# EasyEDA Pro project ax08_duplicate.eprj, board ax08 1.0
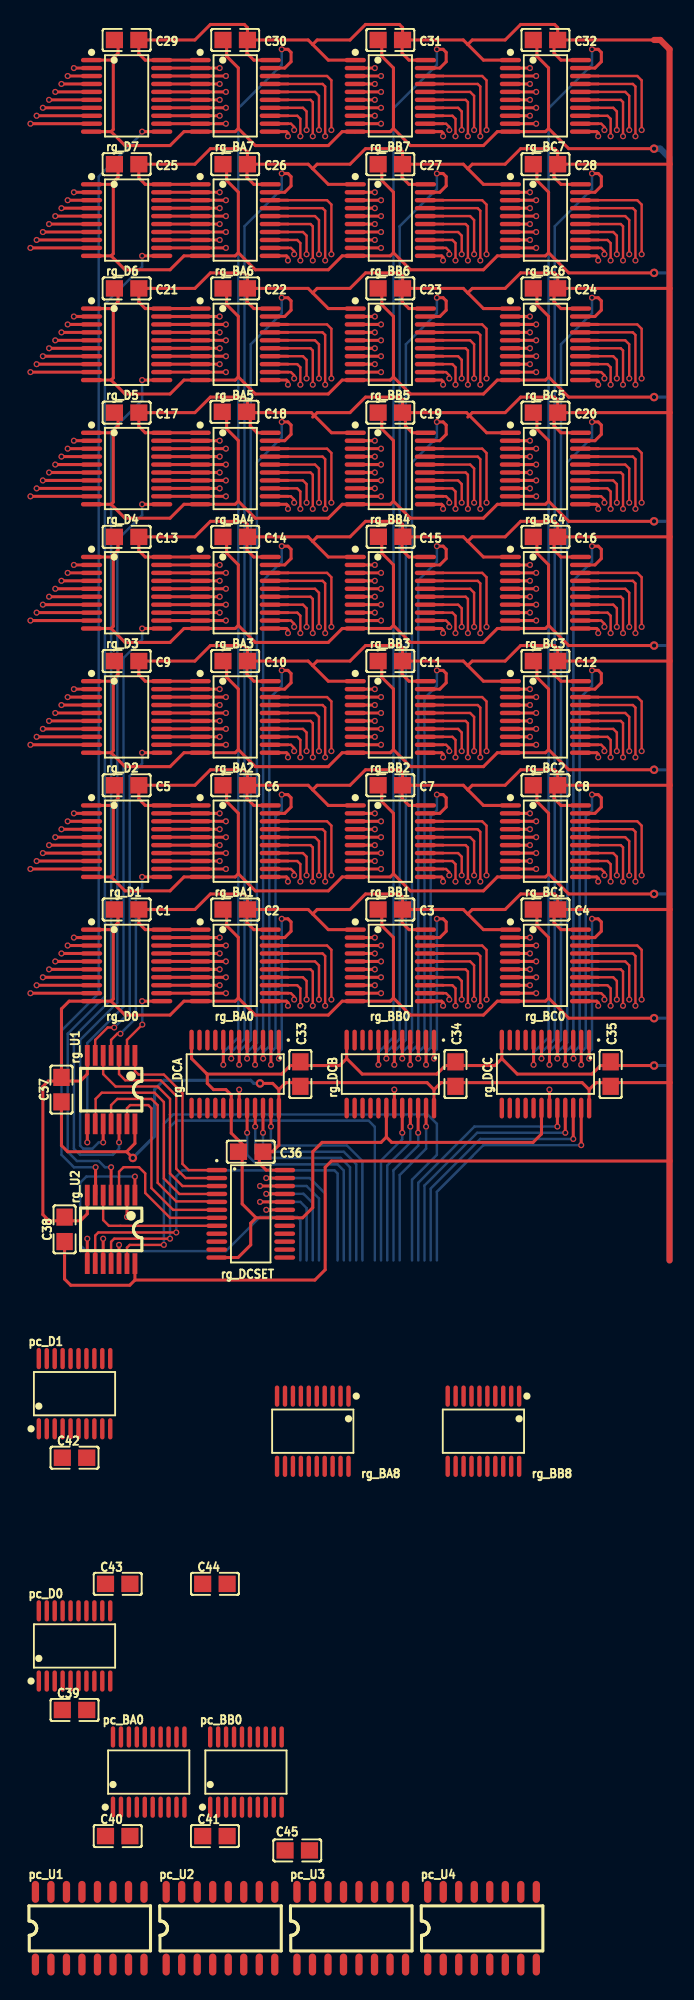
[diagram p7: board, top side]
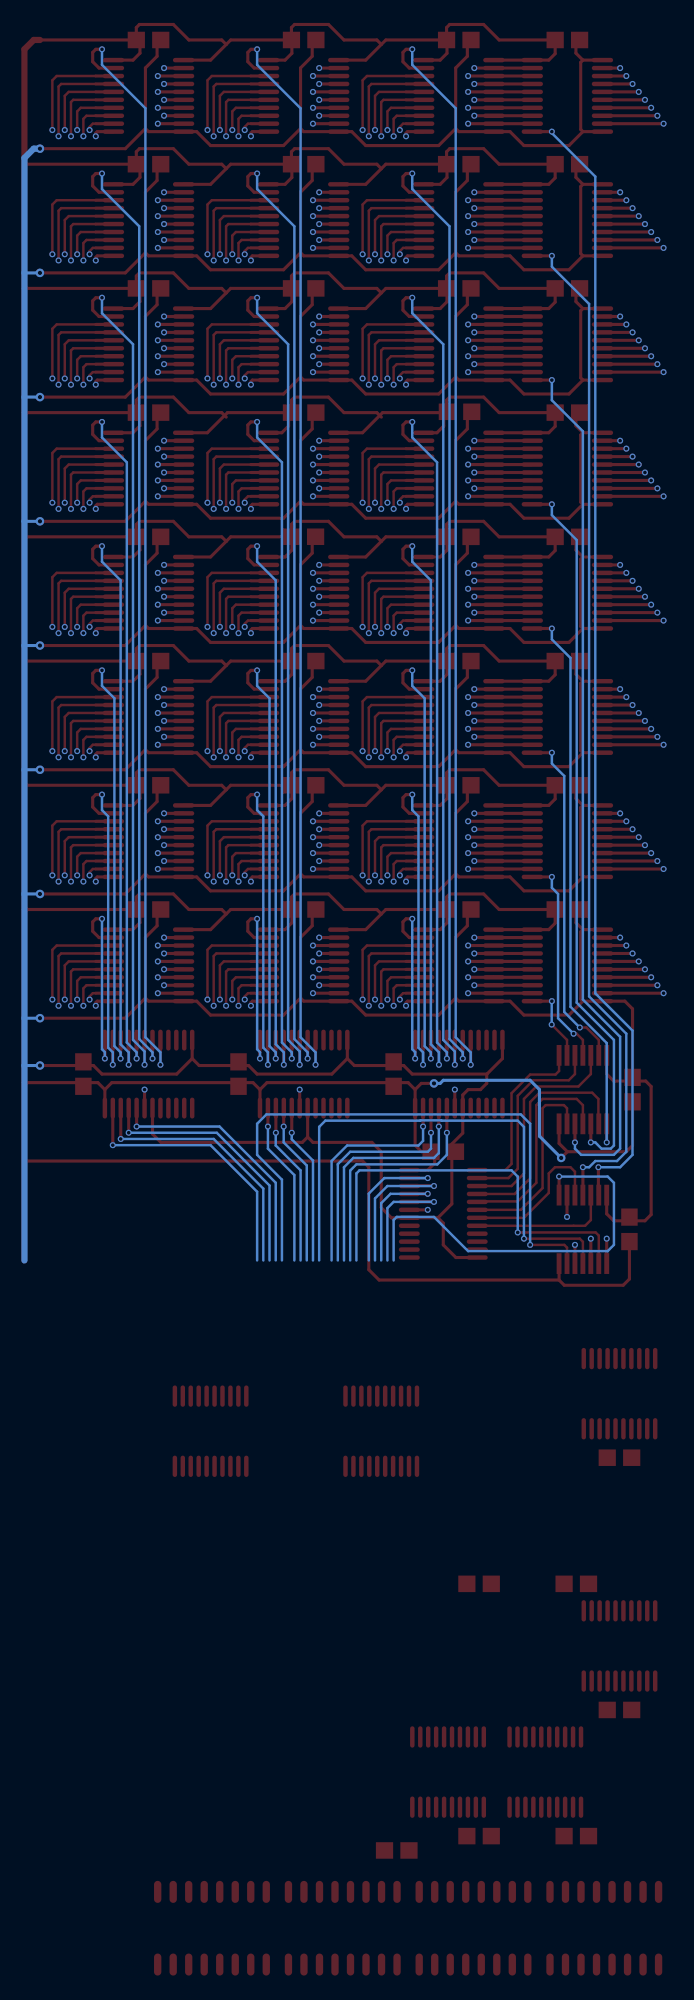
[diagram p8: board, bottom side, seen from below]

No outline. copper layers: Top Layer, Inner1, Inner2, Bottom Layer. Coordinates in mm from the lowest, leftmost part position.
Stack: Top Layer 0.035mm Outer layer thickness 1oz / Dielectric1 0.2104mm 7628 RC49% 8.6mil / Inner1 0.0152mm Inner layer thickness / Dielectric2 1.065mm 1.1mm H/HOZ Copper / Inner2 0.0152mm Inner layer thickness / Dielectric3 0.2104mm 7628 RC49% 8.6mil / Bottom Layer 0.035mm Outer layer thickness 1oz

## Design rules (mm)
template: JLCPCB Capability(Two Layers Board)
spacing copperThickness1oz (default): track to track 0.102, other pairs 0.152 to 0.3
spacing copperThickness2oz: track to track 0.203, other pairs 0.152 to 0.3
track width copperThickness1oz (default): min 0.127, default 0.254, max 2.54
track width copperThickness2oz: min 0.203, default 0.254, max 2.54
differential pair differentialPair (default): width min 0.127, default 0.254, max 2.54; gap min 0.152, default 0.152
via viaSize (default): diameter min 0.5, default 0.61, max 10; hole min 0.3, default 0.305, max 6.3

## Placement (name value [footprint] x y rotation side)
C1  100nF  [C0805]  5.33 83.32 0 top
C2  100nF  [C0805]  14.22 83.32 0 top
C3  100nF  [C0805]  26.92 83.32 0 top
C4  100nF  [C0805]  39.62 83.32 0 top
C5  100nF  [C0805]  5.33 93.48 0 top
C6  100nF  [C0805]  14.22 93.48 0 top
C7  100nF  [C0805]  26.92 93.48 0 top
C8  100nF  [C0805]  39.62 93.48 0 top
C9  100nF  [C0805]  5.33 103.64 0 top
C10  100nF  [C0805]  14.22 103.64 0 top
C11  100nF  [C0805]  26.92 103.64 0 top
C12  100nF  [C0805]  39.62 103.64 0 top
C13  100nF  [C0805]  5.33 113.8 0 top
C14  100nF  [C0805]  14.22 113.8 0 top
C15  100nF  [C0805]  26.95 113.81 0 top
C16  100nF  [C0805]  39.62 113.8 0 top
C17  100nF  [C0805]  5.33 123.96 0 top
C18  100nF  [C0805]  14.16 124.03 0 top
C19  100nF  [C0805]  26.92 123.96 0 top
C20  100nF  [C0805]  39.62 123.96 0 top
C21  100nF  [C0805]  5.33 134.12 0 top
C22  100nF  [C0805]  14.22 134.12 0 top
C23  100nF  [C0805]  26.92 134.12 0 top
C24  100nF  [C0805]  39.62 134.12 0 top
C25  100nF  [C0805]  5.33 144.28 0 top
C26  100nF  [C0805]  14.22 144.28 0 top
C27  100nF  [C0805]  26.92 144.28 0 top
C28  100nF  [C0805]  39.62 144.28 0 top
C29  100nF  [C0805]  5.33 154.44 0 top
C30  100nF  [C0805]  14.22 154.44 0 top
C31  100nF  [C0805]  26.92 154.44 0 top
C32  100nF  [C0805]  39.62 154.44 0 top
C33  100nF  [C0805]  19.56 69.86 90 top
C34  100nF  [C0805]  32.26 69.86 90 top
C35  100nF  [C0805]  44.96 69.86 90 top
C36  100nF  [C0805]  15.49 63.51 180 top
C37  100nF  [C0805]  0 68.59 270 top
C38  100nF  [C0805]  0.25 57.16 270 top
C39  100nF  [C0805]  1.07 17.85 0 top
C40  100nF  [C0805]  4.6 7.53 0 top
C41  100nF  [C0805]  12.56 7.53 0 top
C42  100nF  [C0805]  1.07 38.48 0 top
C43  100nF  [C0805]  4.6 28.17 0 top
C44  100nF  [C0805]  12.56 28.17 0 top
C45  100nF  [C0805]  19.3 6.36 0 top
pc_BA0  74HC245PW,118  [TSSOP-20_L6.5-W4.4-P0.65-LS6.4-BL]  7.14 12.77 0 top
pc_BB0  74HC245PW,118  [TSSOP-20_L6.5-W4.4-P0.65-LS6.4-BL]  15.1 12.77 0 top
pc_D0  74HC574PW,118  [TSSOP-20_L6.5-W4.4-P0.65-LS6.4-BL]  1.07 23.09 0 top
pc_D1  74HC574PW,118  [TSSOP-20_L6.5-W4.4-P0.65-LS6.4-BL]  1.07 43.72 0 top
pc_U1  SN74LS283DR(LX)  [SOIC-16_L9.9-W3.9-P1.27-LS6.0-BL-1]  2.31 0 0 top
pc_U2  SN74LS283DR(LX)  [SOIC-16_L9.9-W3.9-P1.27-LS6.0-BL-1]  13.02 0 0 top
pc_U3  SN74LS283DR(LX)  [SOIC-16_L9.9-W3.9-P1.27-LS6.0-BL-1]  23.72 0 0 top
pc_U4  SN74LS283DR(LX)  [SOIC-16_L9.9-W3.9-P1.27-LS6.0-BL-1]  34.43 0 0 top
rg_BA0  74HC245PW,118  [TSSOP-20_L6.5-W4.4-P0.65-LS6.4-BL]  14.22 78.75 270 top
rg_BA1  74HC245PW,118  [TSSOP-20_L6.5-W4.4-P0.65-LS6.4-BL]  14.22 88.91 270 top
rg_BA2  74HC245PW,118  [TSSOP-20_L6.5-W4.4-P0.65-LS6.4-BL]  14.22 99.07 270 top
rg_BA3  74HC245PW,118  [TSSOP-20_L6.5-W4.4-P0.65-LS6.4-BL]  14.22 109.23 270 top
rg_BA4  74HC245PW,118  [TSSOP-20_L6.5-W4.4-P0.65-LS6.4-BL]  14.22 119.39 270 top
rg_BA5  74HC245PW,118  [TSSOP-20_L6.5-W4.4-P0.65-LS6.4-BL]  14.22 129.55 270 top
rg_BA6  74HC245PW,118  [TSSOP-20_L6.5-W4.4-P0.65-LS6.4-BL]  14.22 139.71 270 top
rg_BA7  74HC245PW,118  [TSSOP-20_L6.5-W4.4-P0.65-LS6.4-BL]  14.22 149.87 270 top
rg_BA8  74HC245PW,118  [TSSOP-20_L6.5-W4.4-P0.65-LS6.4-BL]  20.57 40.65 180 top
rg_BB0  74HC245PW,118  [TSSOP-20_L6.5-W4.4-P0.65-LS6.4-BL]  26.92 78.75 270 top
rg_BB1  74HC245PW,118  [TSSOP-20_L6.5-W4.4-P0.65-LS6.4-BL]  26.92 88.91 270 top
rg_BB2  74HC245PW,118  [TSSOP-20_L6.5-W4.4-P0.65-LS6.4-BL]  26.92 99.07 270 top
rg_BB3  74HC245PW,118  [TSSOP-20_L6.5-W4.4-P0.65-LS6.4-BL]  26.92 109.23 270 top
rg_BB4  74HC245PW,118  [TSSOP-20_L6.5-W4.4-P0.65-LS6.4-BL]  26.92 119.39 270 top
rg_BB5  74HC245PW,118  [TSSOP-20_L6.5-W4.4-P0.65-LS6.4-BL]  26.92 129.55 270 top
rg_BB6  74HC245PW,118  [TSSOP-20_L6.5-W4.4-P0.65-LS6.4-BL]  26.92 139.71 270 top
rg_BB7  74HC245PW,118  [TSSOP-20_L6.5-W4.4-P0.65-LS6.4-BL]  26.92 149.87 270 top
rg_BB8  74HC245PW,118  [TSSOP-20_L6.5-W4.4-P0.65-LS6.4-BL]  34.54 40.65 180 top
rg_BC0  74HC245PW,118  [TSSOP-20_L6.5-W4.4-P0.65-LS6.4-BL]  39.62 78.75 270 top
rg_BC1  74HC245PW,118  [TSSOP-20_L6.5-W4.4-P0.65-LS6.4-BL]  39.62 88.91 270 top
rg_BC2  74HC245PW,118  [TSSOP-20_L6.5-W4.4-P0.65-LS6.4-BL]  39.62 99.07 270 top
rg_BC3  74HC245PW,118  [TSSOP-20_L6.5-W4.4-P0.65-LS6.4-BL]  39.62 109.23 270 top
rg_BC4  74HC245PW,118  [TSSOP-20_L6.5-W4.4-P0.65-LS6.4-BL]  39.62 119.39 270 top
rg_BC5  74HC245PW,118  [TSSOP-20_L6.5-W4.4-P0.65-LS6.4-BL]  39.62 129.55 270 top
rg_BC6  74HC245PW,118  [TSSOP-20_L6.5-W4.4-P0.65-LS6.4-BL]  39.62 139.71 270 top
rg_BC7  74HC245PW,118  [TSSOP-20_L6.5-W4.4-P0.65-LS6.4-BL]  39.62 149.87 270 top
rg_D0  74HC574PW,118  [TSSOP-20_L6.5-W4.4-P0.65-LS6.4-BL]  5.33 78.75 270 top
rg_D1  74HC574PW,118  [TSSOP-20_L6.5-W4.4-P0.65-LS6.4-BL]  5.33 88.91 270 top
rg_D2  74HC574PW,118  [TSSOP-20_L6.5-W4.4-P0.65-LS6.4-BL]  5.33 99.07 270 top
rg_D3  74HC574PW,118  [TSSOP-20_L6.5-W4.4-P0.65-LS6.4-BL]  5.33 109.23 270 top
rg_D4  74HC574PW,118  [TSSOP-20_L6.5-W4.4-P0.65-LS6.4-BL]  5.33 119.39 270 top
rg_D5  74HC574PW,118  [TSSOP-20_L6.5-W4.4-P0.65-LS6.4-BL]  5.33 129.55 270 top
rg_D6  74HC574PW,118  [TSSOP-20_L6.5-W4.4-P0.65-LS6.4-BL]  5.33 139.71 270 top
rg_D7  74HC574PW,118  [TSSOP-20_L6.5-W4.4-P0.65-LS6.4-BL]  5.33 149.87 270 top
rg_DCA  SN74HC154PW(LX)  [TSSOP-24_L7.8-W4.4-P0.65-LS6.4-BL_1]  14.22 69.86 180 top
rg_DCB  SN74HC154PW(LX)  [TSSOP-24_L7.8-W4.4-P0.65-LS6.4-BL_1]  26.92 69.86 180 top
rg_DCC  SN74HC154PW(LX)  [TSSOP-24_L7.8-W4.4-P0.65-LS6.4-BL_1]  39.62 69.86 180 top
rg_DCSET  SN74HC154PW(LX)  [TSSOP-24_L7.8-W4.4-P0.65-LS6.4-BL_1]  15.49 58.43 270 top
rg_U1  74HC14PW,118  [TSSOP-14_L5.0-W4.4-P0.65-LS6.4-BL]  4.06 68.59 180 top
rg_U2  74HC14PW,118  [TSSOP-14_L5.0-W4.4-P0.65-LS6.4-BL]  4.06 57.16 180 top

## Footprints (pads in the part's own frame, mm; a bottom-side part is the same pattern mirrored in y, then rotated)
C0805
  rect 1.41x1.35 smd: 1(-1,0) 2(1,0)
SOIC-16_L9.9-W3.9-P1.27-LS6.0-BL-1
  oval 0.6x1.8 smd: 1(-4.445,-2.972) 2(-3.175,-2.972) 3(-1.905,-2.972) 4(-0.635,-2.972) 5(0.635,-2.972) 6(1.905,-2.972) 7(3.175,-2.972) 8(4.445,-2.972) 9(4.445,2.972) 10(3.175,2.972) 11(1.905,2.972) 12(0.635,2.972) 13(-0.635,2.972) 14(-1.905,2.972) 15(-3.175,2.972) 16(-4.445,2.972)
TSSOP-14_L5.0-W4.4-P0.65-LS6.4-BL
  rect 0.4x1.7 smd: 1(-1.95,-2.8) 2(-1.3,-2.8) 3(-0.65,-2.8) 4(0,-2.8) 5(0.65,-2.8) 6(1.3,-2.8) 7(1.95,-2.8) 8(1.95,2.8) 9(1.3,2.8) 10(0.65,2.8) 11(0,2.8) 12(-0.65,2.8) 13(-1.3,2.8) 14(-1.95,2.8)
TSSOP-20_L6.5-W4.4-P0.65-LS6.4-BL
  oval 0.364x1.742 smd: 1(-2.925,-2.871) 2(-2.275,-2.871) 3(-1.625,-2.871) 4(-0.975,-2.871) 5(-0.325,-2.871) 6(0.325,-2.871) 7(0.975,-2.871) 8(1.625,-2.871) 9(2.275,-2.871) 10(2.925,-2.871) 11(2.925,2.871) 12(2.275,2.871) 13(1.625,2.871) 14(0.975,2.871) 15(0.325,2.871) 16(-0.325,2.871) 17(-0.975,2.871) 18(-1.625,2.871) 19(-2.275,2.871) 20(-2.925,2.871)
TSSOP-24_L7.8-W4.4-P0.65-LS6.4-BL_1
  oval 0.364x1.71 smd: 1(-3.575,-2.78) 2(-2.925,-2.78) 3(-2.275,-2.78) 4(-1.625,-2.78) 5(-0.975,-2.78) 6(-0.325,-2.78) 7(0.325,-2.78) 8(0.975,-2.78) 9(1.625,-2.78) 10(2.275,-2.78) 11(2.925,-2.78) 12(3.575,-2.78) 13(3.575,2.78) 14(2.925,2.78) 15(2.275,2.78) 16(1.625,2.78) 17(0.975,2.78) 18(0.325,2.78) 19(-0.325,2.78) 20(-0.975,2.78) 21(-1.625,2.78) 22(-2.275,2.78) 23(-2.925,2.78) 24(-3.575,2.78)

## Nets
As in the schematic.

Pads without a net: C45 1 2; pc_U1 1 2 3 4 5 6 7 8 9 10 11 12 13 14 15 16; pc_U2 1 2 3 4 5 6 7 8 9 10 11 12 13 14 15 16; pc_U3 1 2 3 4 5 6 7 8 9 10 11 12 13 14 15 16; pc_U4 1 2 3 4 5 6 7 8 9 10 11 12 13 14 15 16; rg_DCA 11 13 14 15 16 17; rg_DCB 11 13 14 15 16 17; rg_DCC 9 10 11 13 14 15 16 17; rg_DCSET 9 10 11 13 14 15 16 17

## Via types
v1: diameter 0.7, hole 0.35, Top Layer to Bottom Layer, 11 vias
v2: diameter 0.5, hole 0.3, Top Layer to Bottom Layer, 540 vias

## Routing (per net, layer and track width the routed paths; a pad name or vN(x,y) marks a point on that pad's centre or on a via; arc(x,y) is an arc through that point)
+5V: length 828.2
  Top Layer w0.254: 33.4,123.73 34.81,122.32 37.02,122.32 ; 33.4,123.73 33.63,123.96 36.32,123.96 37.59,125.23 40.37,125.23 40.62,124.98 C20.2 ; 33.4,123.73 33.26,123.6 ; 33.4,123.73 33.16,123.96 28.16,123.96 28.16,122.87 28.71,122.32 30.06,122.32 ; rg_BB2.20 28.45,102 27.89,102.55 27.89,103.64 C11.2 ; C32.2 40.32,154.44 40.32,153.37 40.89,152.8 rg_BC7.20 ; C32.2 40.62,155.46 40.37,155.71 37.59,155.71 36.32,154.44 33.63,154.44 33.26,154.08 ; C32.2 48.51,154.44 ; rg_BA7.20 15.75,152.8 15.19,153.35 15.19,154.44 C30.2 ; 36.75,132.48 34.54,132.48 33.26,133.76 ; 20.56,154.08 20.93,154.44 23.62,154.44 24.89,155.71 27.67,155.71 27.92,155.46 C31.2 ; 20.56,154.08 21.84,152.8 rg_BB7.1 ; 20.56,154.08 20.2,154.44 C30.2 ; rg_BC3.20 40.89,112.16 40.32,112.73 40.32,113.8 C16.2 ; C4.2 40.32,83.32 40.32,82.25 40.89,81.68 rg_BC0.20 ; C4.2 40.62,84.34 40.37,84.59 37.59,84.59 36.32,83.32 33.63,83.32 33.26,82.96 ; C4.2 49.78,83.32 ; rg_BB3.1 21.84,112.16 20.56,113.44 ; C10.2 15.19,103.64 15.19,102.55 15.75,102 rg_BA2.20 ; C10.2 20.2,103.64 20.56,103.28 ; C10.2 15.22,104.66 14.97,104.91 12.19,104.91 10.92,103.64 C9.2 6.33,102.52 6.86,102 rg_BA2.1 ; C30.2 15.22,155.46 14.97,155.71 12.19,155.71 10.92,154.44 C29.2 6.33,153.32 6.86,152.8 rg_BA7.1 ; rg_BC2.1 34.54,102 33.26,103.28 ; rg_BC0.1 34.54,81.68 33.26,82.96 ; 30.5,68.59 29.93,69.16 18.37,69.16 17.8,68.59 ; 30.5,68.59 rg_DCB.24 ; 30.5,68.59 31.07,69.16 42.63,69.16 43.2,68.59 ; C27.2 27.92,145.3 27.67,145.55 24.89,145.55 23.62,144.28 20.93,144.28 20.56,143.92 ; C14.2 15.22,114.82 14.97,115.07 12.19,115.07 10.92,113.8 C13.2 6.33,112.68 6.86,112.16 rg_BA3.1 ; C14.2 20.2,113.8 20.56,113.44 ; C14.2 15.19,113.8 15.19,112.71 15.75,112.16 rg_BA3.20 ; 20.56,113.44 20.93,113.8 23.62,113.8 24.89,115.07 27.67,115.07 27.92,114.82 27.92,113.8 ; v1(16.26,69.1) 17.29,69.1 17.8,68.59 ; C11.2 32.9,103.64 33.26,103.28 ; C11.2 27.92,104.66 27.67,104.91 24.89,104.91 23.62,103.64 20.93,103.64 20.56,103.28 ; 33.26,154.08 34.54,152.8 rg_BC7.1 ; 33.26,154.08 32.9,154.44 C31.2 ; 6.01,53.02 20.75,53.02 21.59,53.86 21.59,62.24 22.1,62.75 49.78,62.75 ; 6.01,53.02 rg_U2.14 ; 6.01,53.02 5.59,52.59 0.76,52.59 0.25,53.1 0.25,56.46 ; C24.2 40.32,134.12 40.32,133.05 40.89,132.48 42.5,132.48 ; C24.2 49.78,134.12 ; C24.2 40.62,135.14 40.37,135.39 37.59,135.39 36.32,134.12 33.63,134.12 33.26,133.76 ; 17.8,68.59 17.8,64.04 17.27,63.51 16.19,63.51 16.19,62.58 16.76,62.01 rg_DCSET.24 ; 20.56,82.96 21.84,81.68 rg_BB0.1 ; 20.56,82.96 20.93,83.32 23.62,83.32 24.89,84.59 27.67,84.59 27.92,84.34 C3.2 ; 20.56,82.96 20.2,83.32 C2.2 ; 33.26,93.12 33.63,93.48 36.32,93.48 37.59,94.75 40.37,94.75 40.62,94.5 C8.2 ; 33.26,93.12 34.54,91.84 rg_BC1.1 ; 33.26,93.12 32.9,93.48 27.89,93.48 27.89,92.39 28.45,91.84 rg_BB1.20 ; C23.2 27.89,134.12 27.89,133.03 28.45,132.48 29.79,132.48 ; C23.2 32.9,134.12 33.26,133.76 ; C23.2 27.92,135.14 27.67,135.39 24.89,135.39 23.62,134.12 20.93,134.12 20.56,133.76 ; 33.26,103.28 33.63,103.64 36.32,103.64 37.59,104.91 40.37,104.91 40.62,104.66 C12.2 ; C16.2 49.78,113.8 ; C16.2 40.62,114.82 40.37,115.07 37.59,115.07 36.32,113.8 33.63,113.8 33.26,113.44 ; C2.2 15.22,84.34 14.97,84.59 12.19,84.59 10.92,83.32 C1.2 6.33,82.2 6.86,81.68 rg_BA0.1 ; C2.2 15.19,83.32 15.19,82.23 15.75,81.68 rg_BA0.20 ; 20.56,103.28 21.84,102 rg_BB2.1 ; 27.92,113.8 32.9,113.8 33.26,113.44 ; 27.92,113.8 27.89,113.8 27.89,112.71 28.45,112.16 rg_BB3.20 ; C22.2 20.2,134.12 20.56,133.76 ; C22.2 15.19,134.12 15.19,133.03 15.75,132.48 17.09,132.48 ; C22.2 15.22,135.14 14.97,135.39 12.19,135.39 10.92,134.12 C21.2 6.33,133 6.86,132.48 11.35,132.48 ; rg_BC2.20 40.89,102 40.32,102.57 40.32,103.64 C12.2 ; 43.2,68.59 43.77,69.16 49.78,69.16 ; 43.2,68.59 rg_DCC.24 ; rg_BC6.20 40.89,142.64 40.32,143.21 40.32,144.28 49.78,144.28 ; C12.2 49.78,103.64 ; 49.78,93.48 40.32,93.48 40.32,92.41 40.89,91.84 rg_BC1.20 ; 49.78,123.96 40.32,123.96 40.32,122.89 40.89,122.32 42.5,122.32 ; 33.26,82.96 32.9,83.32 C3.2 ; 20.56,143.92 20.2,144.28 15.19,144.28 15.19,143.19 15.75,142.64 rg_BA6.20 ; 20.56,143.92 21.84,142.64 rg_BB6.1 ; rg_BB1.1 21.84,91.84 20.56,93.12 ; rg_BA6.1 6.86,142.64 6.33,143.16 C25.2 10.92,144.28 12.19,145.55 14.97,145.55 15.22,145.3 C26.2 ; 11.35,122.32 6.86,122.32 6.33,122.84 C17.2 10.92,123.96 12.19,125.23 14.97,125.23 15.22,124.98 15.22,123.96 ; C31.2 27.89,154.44 27.89,153.35 28.45,152.8 rg_BB7.20 ; C6.2 15.22,94.5 14.97,94.75 12.19,94.75 10.92,93.48 C5.2 6.33,92.36 6.86,91.84 rg_BA1.1 ; 5.33,63.51 6.01,64.19 rg_U1.14 ; 5.33,63.51 v1(5.84,63) ; 5.33,63.51 0.51,63.51 0,64.02 0,67.89 ; C7.2 27.92,94.5 27.67,94.75 24.89,94.75 23.62,93.48 20.93,93.48 20.56,93.12 ; rg_BB6.20 28.45,142.64 27.89,143.19 27.89,144.28 32.9,144.28 33.26,143.92 ; C3.2 27.89,83.32 27.89,82.23 28.45,81.68 rg_BB0.20 ; 33.26,113.44 34.54,112.16 rg_BC3.1 ; 20.56,133.76 21.84,132.48 24.05,132.48 ; rg_BC6.1 34.54,142.64 33.26,143.92 ; C19.2 27.92,124.98 27.67,125.23 24.89,125.23 23.62,123.96 20.93,123.96 20.7,123.73 ; 20.56,93.12 20.2,93.48 15.19,93.48 15.19,92.39 15.75,91.84 rg_BA1.20 ; 33.26,143.92 33.63,144.28 36.32,144.28 37.59,145.55 40.37,145.55 40.62,145.3 C28.2 ; 17.36,122.32 16.01,122.32 15.46,122.87 15.46,123.96 20.46,123.96 20.7,123.73 ; 20.7,123.73 20.56,123.6 ; 20.7,123.73 22.11,122.32 24.32,122.32
  Top Layer w0.508: 48.51,154.44 49.02,154.44 49.78,153.68 49.78,54.62
  Bottom Layer w0.254: v1(5.84,63) 7.62,64.78 7.62,68.59 8.38,69.35 15.49,69.35 15.75,69.1 v1(16.26,69.1)
GND: length 890.8
  Top Layer w0.254: 2.46,132.48 4.06,132.48 ; 4.06,132.48 4.63,133.05 4.63,134.12 ; 4.06,132.48 4.24,132.3 4.24,126.81 4.06,126.63 ; 4.06,85.99 4.24,86.17 4.24,91.66 4.06,91.84 ; 4.06,85.99 2.46,85.99 ; 4.06,85.99 5.2,84.85 8.89,84.85 10.03,85.99 14.22,85.99 14.48,86.24 ; rg_D7.1 4.06,152.8 ; 4.06,152.8 4.63,153.37 4.63,154.44 ; 4.06,152.8 4.24,152.62 4.24,147.13 4.06,146.95 ; 14.48,76.08 15.87,74.69 21.84,74.69 22.98,75.83 rg_BB0.10 26.92,75.83 27.18,76.08 ; 14.48,76.08 14.22,75.83 rg_BA0.10 10.03,75.83 8.89,74.69 5.2,74.69 4.06,75.83 ; 14.48,76.08 14.48,81.04 13.52,81.99 13.52,83.32 ; 14.48,137.04 15.87,135.65 21.84,135.65 22.98,136.79 rg_BB6.10 26.92,136.79 27.18,137.04 ; 14.48,137.04 14.22,136.79 rg_BA6.10 10.03,136.79 8.89,135.65 5.2,135.65 4.06,136.79 ; 14.48,137.04 14.48,142 13.52,142.95 13.52,144.28 ; 11.92,69.86 11.94,69.84 11.94,69.1 12.45,68.59 13.46,68.59 13.9,68.15 rg_DCA.18 13.9,65.04 14.79,64.14 14.79,59.24 15.93,58.11 ; 11.92,69.86 18.03,69.86 18.73,70.56 22.78,70.56 23.35,71.13 ; 11.92,69.86 10.65,71.13 rg_DCA.12 ; 27.18,147.2 26.92,146.95 rg_BB7.10 22.98,146.95 21.84,145.81 15.87,145.81 14.48,147.2 ; 27.18,147.2 28.57,145.81 34.54,145.81 35.68,146.95 rg_BC7.10 39.62,146.95 39.88,147.2 ; 27.18,147.2 27.18,152.16 26.22,153.11 26.22,154.44 ; 15.93,58.11 rg_DCSET.18 19.74,58.11 20.57,58.94 20.57,63.51 21.34,64.27 26.16,64.27 26.6,64.71 ; 15.93,58.11 15.49,57.67 15.49,55.89 14.46,54.86 12.71,54.86 ; 0,69.29 0,75.2 0.63,75.83 rg_D0.10 4.06,75.83 ; 0,69.29 -1.08,69.29 -1.52,68.85 -1.52,58.37 -1.02,57.86 1.54,57.86 2.11,58.43 rg_U2.7 ; 0,69.29 1.54,69.29 2.11,69.86 rg_U1.7 ; 4.06,81.68 4.24,81.5 4.24,76.01 4.06,75.83 ; 4.06,81.68 4.63,82.25 4.63,83.32 ; 4.06,81.68 rg_D0.1 ; 27.18,137.04 27.18,142 26.22,142.95 26.22,144.28 ; 27.18,137.04 28.57,135.65 34.54,135.65 35.68,136.79 rg_BC6.10 39.62,136.79 39.88,137.04 ; 36.05,71.13 37.32,69.86 43.43,69.86 44.13,70.56 v1(48.51,70.56) ; 36.05,71.13 35.48,70.56 31.43,70.56 30.73,69.86 24.62,69.86 23.35,71.13 ; 36.05,71.13 rg_DCC.12 ; 2.46,106.31 4.06,106.31 ; 4.06,106.31 4.24,106.49 4.24,111.98 4.06,112.16 ; 4.06,106.31 5.2,105.17 8.89,105.17 10.03,106.31 14.22,106.31 14.48,106.56 ; rg_DCC.18 39.3,64.96 38.61,64.27 27.04,64.27 26.6,64.71 ; 14.48,86.24 14.48,91.2 13.52,92.15 13.52,93.48 ; 14.48,86.24 15.87,84.85 21.84,84.85 22.98,85.99 26.92,85.99 27.18,86.24 ; 39.88,86.24 39.88,91.2 38.92,92.15 38.92,93.48 ; 39.88,86.24 41.53,84.59 v1(48.51,84.59) ; 39.88,86.24 39.62,85.99 35.68,85.99 34.54,84.85 28.57,84.85 27.18,86.24 ; 39.88,126.88 39.88,131.84 38.92,132.79 38.92,134.12 ; 39.88,126.88 41.53,125.23 v1(48.51,125.23) ; 39.88,126.88 39.62,126.63 rg_BC5.10 35.68,126.63 34.54,125.49 28.57,125.49 27.18,126.88 ; 27.18,126.88 26.92,126.63 rg_BB5.10 22.98,126.63 21.84,125.49 15.87,125.49 14.48,126.88 ; 27.18,126.88 27.18,131.84 26.22,132.79 26.22,134.12 ; 4.06,96.15 4.24,96.33 4.24,101.82 4.06,102 ; 4.06,96.15 5.2,95.01 8.89,95.01 10.03,96.15 14.22,96.15 14.48,96.4 ; 4.06,96.15 2.46,96.15 ; 39.88,147.2 41.53,145.55 v1(48.51,145.55) ; 39.88,147.2 39.88,152.16 38.92,153.11 38.92,154.44 ; 4.06,91.84 rg_D1.1 ; 4.06,91.84 4.63,92.41 4.63,93.48 ; 13.52,154.44 13.52,153.11 14.48,152.16 14.48,147.2 ; 13.52,134.12 13.52,132.79 14.48,131.84 14.48,126.88 ; 39.88,106.56 39.62,106.31 35.68,106.31 34.54,105.17 28.57,105.17 27.18,106.56 ; 39.88,106.56 39.88,111.52 38.92,112.47 38.92,113.8 ; 39.88,106.56 41.53,104.91 v1(48.51,104.91) ; 27.18,116.72 27.18,121.68 26.22,122.63 26.22,123.96 ; 27.18,116.72 26.92,116.47 rg_BB4.10 22.98,116.47 21.84,115.33 15.87,115.33 14.48,116.72 ; 27.18,116.72 28.57,115.33 34.54,115.33 35.68,116.47 rg_BC4.10 39.62,116.47 39.88,116.72 ; 39.88,76.08 39.88,81.04 38.92,81.99 38.92,83.32 ; 39.88,76.08 41.53,74.43 v1(48.51,74.43) ; 39.88,76.08 39.62,75.83 rg_BC0.10 35.68,75.83 34.54,74.69 28.57,74.69 27.18,76.08 ; 4.06,146.95 5.2,145.81 8.89,145.81 10.03,146.95 rg_BA7.10 14.22,146.95 14.48,147.2 ; 4.06,146.95 rg_D7.10 ; 4.06,116.47 4.24,116.65 4.24,122.14 4.06,122.32 ; 4.06,116.47 rg_D4.10 ; 4.06,116.47 5.2,115.33 8.89,115.33 10.03,116.47 rg_BA4.10 14.22,116.47 14.48,116.72 ; 4.06,102 4.63,102.57 4.63,103.64 ; 4.06,102 rg_D2.1 ; 13.52,113.8 13.52,112.47 14.48,111.52 14.48,106.56 ; 23.35,71.13 23.35,72.64 ; 27.18,86.24 27.18,91.2 26.22,92.15 26.22,93.48 ; 14.48,96.4 15.87,95.01 21.84,95.01 22.98,96.15 26.92,96.15 27.18,96.4 ; 14.48,96.4 14.48,101.36 13.52,102.31 13.52,103.64 ; v1(48.51,115.07) 41.53,115.07 39.88,116.72 ; 13.52,123.96 13.52,122.63 14.48,121.68 14.48,116.72 ; 39.88,116.72 39.88,121.68 38.92,122.63 38.92,123.96 ; 4.06,112.16 4.63,112.73 4.63,113.8 ; 4.06,112.16 rg_D3.1 ; 27.18,76.08 27.18,81.04 26.22,81.99 26.22,83.32 ; rg_DCB.18 26.6,64.71 ; v1(48.51,135.39) 41.53,135.39 39.88,137.04 ; rg_D5.10 4.06,126.63 ; 4.06,126.63 5.2,125.49 8.89,125.49 10.03,126.63 rg_BA5.10 14.22,126.63 14.48,126.88 ; 4.06,122.32 4.63,122.89 4.63,123.96 ; 4.06,122.32 2.46,122.32 ; 4.06,136.79 4.24,136.97 4.24,142.46 4.06,142.64 ; 4.06,136.79 rg_D6.10 ; 14.48,106.56 15.87,105.17 21.84,105.17 22.98,106.31 26.92,106.31 27.18,106.56 ; 27.18,96.4 27.18,101.36 26.22,102.31 26.22,103.64 ; 27.18,96.4 28.57,95.01 34.54,95.01 35.68,96.15 39.62,96.15 39.88,96.4 ; 39.88,96.4 41.53,94.75 v1(48.51,94.75) ; 39.88,96.4 39.88,101.36 38.92,102.31 38.92,103.64 ; 4.06,142.64 rg_D6.1 ; 4.06,142.64 4.63,143.21 4.63,144.28 ; 27.18,106.56 27.18,111.52 26.22,112.47 26.22,113.8 ; 39.88,137.04 39.88,142 38.92,142.95 38.92,144.28
  Bottom Layer w0.254: v1(48.51,74.43) 49.78,74.43 ; v1(48.51,70.56) 49.78,70.56 ; v1(48.51,84.59) 49.78,84.59 ; v1(48.51,104.91) 49.78,104.91 ; v1(48.51,115.07) 49.78,115.07 ; v1(48.51,94.75) 49.78,94.75 ; v1(48.51,125.23) 49.78,125.23 ; v1(48.51,135.39) 49.78,135.39
  Bottom Layer w0.508: 49.78,54.62 49.78,144.79 49.02,145.55 v1(48.51,145.55)
A0: length 166.2
  Top Layer w0.203: 18.54,80.38 21.74,80.38 22.1,80.02 v2(22.1,75.96) ; v2(22.1,86.12) 22.1,90.18 21.74,90.54 18.54,90.54 ; 18.54,141.34 21.74,141.34 22.1,140.98 v2(22.1,136.92) ; v2(22.1,96.28) 22.1,100.34 21.74,100.7 18.54,100.7 ; v2(22.1,116.6) 22.1,120.66 21.74,121.02 18.54,121.02 ; 18.54,110.86 21.74,110.86 22.1,110.5 v2(22.1,106.44) ; v2(22.1,147.08) 22.1,151.14 21.74,151.5 18.54,151.5 ; v2(22.1,126.76) 22.1,130.82 21.74,131.18 18.54,131.18
  Top Layer w0.254: rg_BA0.18 18.54,80.38 ; rg_BA7.18 18.54,151.5 ; rg_BA5.18 18.54,131.18 ; rg_BA6.18 18.54,141.34 ; rg_BA1.18 18.54,90.54 ; rg_BA3.18 18.54,110.86 ; rg_BA2.18 18.54,100.7 ; rg_BA4.18 18.54,121.02
  Inner1 w0.203: v2(22.1,147.08) v2(22.1,136.92) v2(22.1,126.76) v2(22.1,116.6) v2(22.1,106.44) v2(22.1,96.28) v2(22.1,86.12) v2(22.1,75.96) 22.1,54.62
A1: length 161.1
  Top Layer w0.203: v2(21.59,126.25) 21.59,130.31 21.38,130.53 18.54,130.53 ; 18.54,120.37 21.38,120.37 21.59,120.15 v2(21.59,116.09) ; 18.54,89.89 21.38,89.89 21.59,89.67 v2(21.59,85.61) ; 18.54,100.05 21.38,100.05 21.59,99.83 v2(21.59,95.77) ; v2(21.59,146.57) 21.59,150.63 21.38,150.85 18.54,150.85 ; v2(21.59,75.45) 21.59,79.51 21.38,79.73 18.54,79.73 ; v2(21.59,105.93) 21.59,109.99 21.38,110.21 18.54,110.21 ; 18.54,140.69 21.38,140.69 21.59,140.47 v2(21.59,136.41)
  Top Layer w0.254: 17.09,110.21 18.54,110.21 ; rg_BA1.17 18.54,89.89 ; rg_BA2.17 18.54,100.05 ; rg_BA6.17 18.54,140.69 ; rg_BA4.17 18.54,120.37 ; rg_BA7.17 18.54,150.85 ; rg_BA0.17 18.54,79.73 ; rg_BA5.17 18.54,130.53
  Inner1 w0.203: 21.59,54.62 v2(21.59,75.45) v2(21.59,85.61) v2(21.59,95.77) v2(21.59,105.93) v2(21.59,116.09) v2(21.59,126.25) v2(21.59,136.41) v2(21.59,146.57)
A2: length 147.8
  Top Layer w0.203: 18.54,109.56 20.76,109.56 21.08,109.23 v2(21.08,106.44) ; v2(21.08,75.96) 21.08,78.75 20.76,79.08 18.54,79.08 ; 18.54,89.24 20.76,89.24 21.08,88.91 v2(21.08,86.12) ; v2(21.08,147.08) 21.08,149.87 20.76,150.2 18.54,150.2 ; v2(21.08,96.28) 21.08,99.07 20.76,99.4 18.54,99.4 ; v2(21.08,136.92) 21.08,139.71 20.76,140.04 18.54,140.04 ; 18.54,119.72 20.76,119.72 21.08,119.39 v2(21.08,116.6) ; v2(21.08,126.76) 21.08,129.55 20.76,129.88 18.54,129.88
  Top Layer w0.254: 18.54,129.88 rg_BA5.16 ; 18.54,150.2 rg_BA7.16 ; 18.54,119.72 rg_BA4.16 ; 18.54,89.24 rg_BA1.16 ; 18.54,99.4 rg_BA2.16 ; 18.54,79.08 rg_BA0.16 ; 18.54,109.56 rg_BA3.16 ; 18.54,140.04 rg_BA6.16
  Inner1 w0.203: 21.08,54.62 v2(21.08,75.96) v2(21.08,86.12) v2(21.08,96.28) v2(21.08,106.44) v2(21.08,116.6) v2(21.08,126.76) v2(21.08,136.92) v2(21.08,147.08)
A3: length 142.7
  Top Layer w0.203: 18.54,98.75 20.39,98.75 20.57,98.56 v2(20.57,95.77) ; 18.54,108.91 20.39,108.91 20.57,108.72 v2(20.57,105.93) ; 18.54,88.59 20.39,88.59 20.57,88.4 v2(20.57,85.61) ; 18.54,139.39 20.39,139.39 20.57,139.2 v2(20.57,136.41) ; 18.54,78.43 20.39,78.43 20.57,78.24 v2(20.57,75.45) ; 18.54,119.07 20.39,119.07 20.57,118.88 v2(20.57,116.09) ; v2(20.57,146.57) 20.57,149.36 20.39,149.55 18.54,149.55 ; 18.54,129.23 20.39,129.23 20.57,129.04 v2(20.57,126.25)
  Top Layer w0.254: rg_BA3.15 18.54,108.91 ; rg_BA0.15 18.54,78.43 ; rg_BA2.15 18.54,98.75 ; rg_BA7.15 18.54,149.55 ; rg_BA4.15 18.54,119.07 ; 17.09,139.39 18.54,139.39 ; rg_BA5.15 18.54,129.23 ; rg_BA1.15 18.54,88.59
  Inner1 w0.203: v2(20.57,146.57) v2(20.57,136.41) v2(20.57,126.25) v2(20.57,116.09) v2(20.57,105.93) v2(20.57,95.77) v2(20.57,85.61) v2(20.57,75.45) 20.57,54.62
A4: length 129.4
  Top Layer w0.203: 18.54,138.74 19.77,138.74 20.07,138.44 v2(20.07,136.92) ; v2(20.07,86.12) 20.07,87.64 19.77,87.94 18.54,87.94 ; 18.54,118.42 19.77,118.42 20.07,118.12 v2(20.07,116.6) ; v2(20.07,75.96) 20.07,77.48 19.77,77.78 18.54,77.78 ; v2(20.07,106.44) 20.07,107.96 19.77,108.26 18.54,108.26 ; 18.54,98.1 19.77,98.1 20.07,97.8 v2(20.07,96.28) ; 18.54,128.58 19.77,128.58 20.07,128.28 v2(20.07,126.76) ; 18.54,148.9 19.77,148.9 20.07,148.6 v2(20.07,147.08)
  Top Layer w0.254: 17.09,128.58 18.54,128.58 ; rg_BA3.14 18.54,108.26 ; 17.09,148.9 18.54,148.9 ; rg_BA6.14 18.54,138.74 ; 17.09,118.42 18.54,118.42 ; rg_BA1.14 18.54,87.94 ; rg_BA0.14 18.54,77.78 ; rg_BA2.14 18.54,98.1
  Inner1 w0.203: 20.07,54.62 v2(20.07,75.96) v2(20.07,86.12) v2(20.07,96.28) v2(20.07,106.44) v2(20.07,116.6) v2(20.07,126.76) v2(20.07,136.92) v2(20.07,147.08)
A5: length 123.9
  Top Layer w0.203: 18.54,77.13 19.3,77.13 19.56,76.87 v2(19.56,75.45) ; 18.54,107.61 19.3,107.61 19.56,107.35 v2(19.56,105.93) ; v2(19.56,146.57) 19.56,147.99 19.3,148.25 18.54,148.25 ; v2(19.56,116.09) 19.56,117.51 19.3,117.77 18.54,117.77 ; 18.54,87.29 19.3,87.29 19.56,87.03 v2(19.56,85.61) ; v2(19.56,136.41) 19.56,137.83 19.3,138.09 18.54,138.09 ; v2(19.56,126.25) 19.56,127.67 19.3,127.93 18.54,127.93 ; 18.54,97.45 19.3,97.45 19.56,97.19 v2(19.56,95.77)
  Top Layer w0.254: rg_BA0.13 18.54,77.13 ; rg_BA1.13 18.54,87.29 ; rg_BA7.13 18.54,148.25 ; rg_BA4.13 18.54,117.77 ; rg_BA5.13 18.54,127.93 ; rg_BA6.13 18.54,138.09 ; rg_BA2.13 18.54,97.45 ; rg_BA3.13 18.54,107.61
  Inner1 w0.203: v2(19.56,146.57) v2(19.56,136.41) v2(19.56,126.25) v2(19.56,116.09) v2(19.56,105.93) v2(19.56,95.77) v2(19.56,85.61) v2(19.56,75.45) 19.56,54.62
A6: length 111
  Top Layer w0.203: 18.54,147.6 18.78,147.6 19.05,147.33 v2(19.05,147.08) ; v2(19.05,106.44) 19.05,106.69 18.78,106.96 18.54,106.96 ; 18.54,96.8 18.78,96.8 19.05,96.53 v2(19.05,96.28) ; 18.54,127.28 18.78,127.28 19.05,127.01 v2(19.05,126.76) ; v2(19.05,116.6) 19.05,116.85 18.78,117.12 18.54,117.12 ; v2(19.05,86.12) 19.05,86.37 18.78,86.64 18.54,86.64 ; v2(19.05,75.96) 19.05,76.21 18.78,76.48 18.54,76.48 ; 18.54,137.44 18.78,137.44 19.05,137.17 v2(19.05,136.92)
  Top Layer w0.254: rg_BA5.12 18.54,127.28 ; rg_BA0.12 18.54,76.48 ; rg_BA3.12 18.54,106.96 ; rg_BA1.12 18.54,86.64 ; rg_BA6.12 18.54,137.44 ; rg_BA7.12 18.54,147.6 ; rg_BA2.12 18.54,96.8 ; rg_BA4.12 18.54,117.12
  Inner1 w0.203: 19.05,54.62 v2(19.05,75.96) v2(19.05,86.12) v2(19.05,96.28) v2(19.05,106.44) v2(19.05,116.6) v2(19.05,126.76) v2(19.05,136.92) v2(19.05,147.08)
A7: length 106
  Top Layer w0.254: 17.09,106.31 18.42,106.31 18.54,106.18 v2(18.54,105.93) ; v2(18.54,95.77) 18.54,96.02 18.42,96.15 17.09,96.15 ; v2(18.54,75.45) 18.54,75.7 18.42,75.83 rg_BA0.11 ; v2(18.54,126.25) 18.54,126.5 18.42,126.63 rg_BA5.11 ; rg_BA7.11 18.42,146.95 18.54,146.82 v2(18.54,146.57) ; v2(18.54,136.41) 18.54,136.66 18.42,136.79 rg_BA6.11 ; v2(18.54,116.09) 18.54,116.34 18.42,116.47 rg_BA4.11 ; v2(18.54,85.61) 18.54,85.86 18.42,85.99 17.09,85.99
  Inner1 w0.203: 18.54,54.62 v2(18.54,75.45) v2(18.54,85.61) v2(18.54,95.77) v2(18.54,105.93) v2(18.54,116.09) v2(18.54,126.25) v2(18.54,136.41) v2(18.54,146.57)
AD_RGA0: length 19
  Top Layer w0.254: rg_DCA.23 v2(17.15,65.57)
  Bottom Layer w0.203: 24.64,54.62 24.64,62.75 23.37,64.02 17.53,64.02 17.15,64.4 v2(17.15,65.57)
AD_RGA1: length 19.3
  Top Layer w0.254: rg_DCA.22 v2(16.5,65.06)
  Bottom Layer w0.203: v2(16.5,65.06) 16.5,63.77 16.76,63.51 23.11,63.51 24.13,62.49 24.13,54.62
AD_RGA2: length 19.5
  Top Layer w0.254: v2(15.86,65.57) 15.86,67.07 rg_DCA.21
  Bottom Layer w0.203: 23.62,54.62 23.62,62.24 22.86,63 16.26,63 15.86,63.4 v2(15.86,65.57)
AD_RGA3: length 19.6
  Top Layer w0.254: rg_DCA.20 v2(15.2,65.06)
  Bottom Layer w0.203: 23.11,54.62 23.11,61.97 22.61,62.47 15.98,62.47 15.2,63.26 v2(15.2,65.06)
AD_RGA_EN: length 34.2
  Top Layer w0.203: rg_U2.9 2.76,56.65 3.02,56.91 v2(9.4,56.91)
  Bottom Layer w0.203: 22.61,54.62 22.61,61.73 22.35,61.99 9.91,61.99 9.4,61.48 v2(9.4,56.91)
AD_RGA_NOTEN: length 27.2
  Top Layer w0.254: rg_U2.8 v2(2.11,56.4) ; rg_DCA.19 v2(14.55,68.59)
  Inner2 w0.203: v2(14.55,68.59) 7.37,68.59 6.6,67.83 6.6,57.92 6.1,57.42 2.54,57.42 2.11,56.99 v2(2.11,56.4)
AD_RGB0: length 13.4
  Top Layer w0.254: 29.85,67.08 v2(29.85,65.57)
  Bottom Layer w0.203: v2(29.85,65.57) 29.85,63.77 27.69,61.6 27.69,54.62
AD_RGB1: length 13.3
  Top Layer w0.254: rg_DCB.22 v2(29.2,65.06)
  Bottom Layer w0.203: 27.18,54.62 27.18,61.99 29.21,64.02 29.21,65.05 v2(29.2,65.06)
AD_RGB2: length 13.2
  Top Layer w0.254: v2(28.56,65.57) 28.56,67.07 rg_DCB.21
  Bottom Layer w0.203: 26.67,54.62 26.67,62.38 28.56,64.27 v2(28.56,65.57)
AD_RGB3: length 13.2
  Top Layer w0.254: rg_DCB.20 v2(27.9,65.06)
  Bottom Layer w0.203: v2(27.9,65.06) 27.9,64.53 26.16,62.79 26.16,54.62
AD_RGB_EN: length 44
  Top Layer w0.203: rg_U2.11 4.06,56.15 4.32,56.4 v2(8.89,56.4)
  Bottom Layer w0.203: 25.65,54.62 25.65,65.54 25.15,66.05 17.38,66.05 17.36,66.07 15.65,66.07 15.63,66.05 9.4,66.05 8.89,65.54 v2(8.89,56.4)
AD_RGB_NOTEN: length 38.2
  Top Layer w0.254: rg_U2.10 v2(3.41,56.4) ; rg_DCB.19 v2(27.25,68.59)
  Inner2 w0.203: v2(27.25,68.59) 26.67,68.59 26.16,68.08 7.62,68.08 7.11,67.58 7.11,57.67 6.35,56.91 4.32,56.91 3.81,56.4 v2(3.41,56.4)
AD_RGC0: length 22
  Top Layer w0.254: rg_DCC.23 42.55,67.08 v2(42.55,64.05)
  Bottom Layer w0.203: 30.73,54.62 30.73,60.24 34.54,64.05 v2(42.55,64.05)
AD_RGC1: length 21.8
  Top Layer w0.254: rg_DCC.22 v2(41.9,64.56)
  Bottom Layer w0.203: v2(41.9,64.56) 34.29,64.56 30.23,60.49 30.23,54.62
AD_RGC2: length 21.5
  Top Layer w0.254: v2(41.25,65.06) 41.25,67.08 rg_DCC.21
  Bottom Layer w0.203: v2(41.25,65.06) 34.04,65.06 29.72,60.75 29.72,54.62
AD_RGC3: length 21.2
  Top Layer w0.254: rg_DCC.20 v2(40.6,65.57)
  Bottom Layer w0.203: 29.21,54.62 29.21,60.97 33.81,65.57 v2(40.6,65.57)
AD_RGC_EN: length 49.3
  Top Layer w0.203: rg_U2.13 5.36,55.67 5.59,55.89 v2(8.38,55.89)
  Bottom Layer w0.203: v2(8.38,55.89) 8.38,65.8 9.14,66.56 29.97,66.56 30.73,65.8 30.73,63.26 28.7,61.23 28.7,54.62
AD_RGC_NOTEN: length 49.3
  Top Layer w0.254: rg_DCC.19 v2(39.95,68.59) ; rg_U2.12 v2(4.71,55.89)
  Inner2 w0.203: v2(4.71,55.89) 6.1,55.89 7.62,57.42 7.62,67.32 7.87,67.58 38.35,67.58 39.37,68.59 v2(39.95,68.59)
AD_RGSET0: length 12.3
  Top Layer w0.254: 18.27,61.36 v2(16.76,61.36)
  Bottom Layer w0.203: v2(16.76,61.36) 20.32,61.36 21.59,60.09 21.59,54.62
AD_RGSET1: length 12.3
  Top Layer w0.254: rg_DCSET.22 v2(16.26,60.71)
  Bottom Layer w0.203: v2(16.26,60.71) 20.07,60.71 21.08,59.69 21.08,54.62
AD_RGSET2: length 10.3
  Top Layer w0.254: rg_DCSET.21 18.26,60.07 v2(16.76,60.07)
  Bottom Layer w0.203: 20.57,54.62 20.57,59.31 19.81,60.07 v2(16.76,60.07)
AD_RGSET3: length 10.3
  Top Layer w0.254: rg_DCSET.20 v2(16.26,59.41)
  Bottom Layer w0.203: v2(16.26,59.41) 19.56,59.41 20.07,58.9 20.07,54.62
AD_RGSET_EN: length 34.1
  Top Layer w0.254: rg_U2.1 v2(6.01,61.48)
  Bottom Layer w0.203: v2(6.01,61.48) 2.03,61.48 1.52,60.97 1.52,55.89 2.03,55.38 13.46,55.38 16.26,58.18 19.3,58.18 19.56,57.92 19.56,54.62
AD_RGSET_NOTEN: length 14.9
  Top Layer w0.254: rg_U2.2 v2(5.36,58.18) ; rg_DCSET.19 v2(16.76,58.76)
  Inner1 w0.203: v2(5.36,58.18) 7.29,58.18 7.87,58.76 v2(16.76,58.76)
B0: length 166.2
  Top Layer w0.203: 31.24,141.34 34.44,141.34 34.8,140.98 v2(34.8,136.92) ; v2(34.8,147.08) 34.8,151.14 34.44,151.5 31.24,151.5 ; v2(34.8,116.6) 34.8,120.66 34.44,121.02 31.24,121.02 ; 31.24,110.86 34.44,110.86 34.8,110.5 v2(34.8,106.44) ; 31.24,131.18 34.44,131.18 34.8,130.82 v2(34.8,126.76) ; v2(34.8,86.12) 34.8,90.18 34.44,90.54 31.24,90.54 ; v2(34.8,75.96) 34.8,80.02 34.44,80.38 31.24,80.38 ; v2(34.8,96.28) 34.8,100.34 34.44,100.7 31.24,100.7
  Top Layer w0.254: rg_BB4.18 31.24,121.02 ; rg_BB6.18 31.24,141.34 ; rg_BB1.18 31.24,90.54 ; rg_BB0.18 31.24,80.38 ; rg_BB5.18 31.24,131.18 ; rg_BB3.18 31.24,110.86 ; rg_BB2.18 31.24,100.7 ; rg_BB7.18 31.24,151.5
  Inner1 w0.203: 34.8,54.62 v2(34.8,75.96) v2(34.8,86.12) v2(34.8,96.28) v2(34.8,106.44) v2(34.8,116.6) v2(34.8,126.76) v2(34.8,136.92) v2(34.8,147.08)
B1: length 161.1
  Top Layer w0.203: 31.24,120.37 34.08,120.37 34.29,120.15 v2(34.29,116.09) ; v2(34.29,75.45) 34.29,79.51 34.08,79.73 31.24,79.73 ; v2(34.29,105.93) 34.29,109.99 34.08,110.21 31.24,110.21 ; 31.24,130.53 34.08,130.53 34.29,130.31 v2(34.29,126.25) ; 31.24,89.89 34.08,89.89 34.29,89.67 v2(34.29,85.61) ; v2(34.29,136.41) 34.29,140.47 34.08,140.69 31.24,140.69 ; v2(34.29,95.77) 34.29,99.83 34.08,100.05 31.24,100.05 ; 31.24,150.85 34.08,150.85 34.29,150.63 v2(34.29,146.57)
  Top Layer w0.254: rg_BB0.17 31.24,79.73 ; rg_BB4.17 31.24,120.37 ; rg_BB1.17 31.24,89.89 ; rg_BB7.17 31.24,150.85 ; 29.79,110.21 31.24,110.21 ; rg_BB5.17 31.24,130.53 ; rg_BB2.17 31.24,100.05 ; rg_BB6.17 31.24,140.69
  Inner1 w0.203: v2(34.29,146.57) v2(34.29,136.41) v2(34.29,126.25) v2(34.29,116.09) v2(34.29,105.93) v2(34.29,95.77) v2(34.29,85.61) v2(34.29,75.45) 34.29,54.62
B2: length 147.8
  Top Layer w0.203: 31.24,99.4 33.46,99.4 33.78,99.07 v2(33.78,96.28) ; v2(33.78,136.92) 33.78,139.71 33.46,140.04 31.24,140.04 ; 31.24,150.2 33.46,150.2 33.78,149.87 v2(33.78,147.08) ; 31.24,109.56 33.46,109.56 33.78,109.23 v2(33.78,106.44) ; 31.24,89.24 33.46,89.24 33.78,88.91 v2(33.78,86.12) ; 31.24,129.88 33.46,129.88 33.78,129.55 v2(33.78,126.76) ; 31.24,119.72 33.46,119.72 33.78,119.39 v2(33.78,116.6) ; v2(33.78,75.96) 33.78,78.75 33.46,79.08 31.24,79.08
  Top Layer w0.254: 31.24,79.08 rg_BB0.16 ; 31.24,109.56 rg_BB3.16 ; 31.24,89.24 rg_BB1.16 ; 31.24,129.88 rg_BB5.16 ; 31.24,150.2 rg_BB7.16 ; 31.24,99.4 rg_BB2.16 ; 31.24,140.04 rg_BB6.16 ; 31.24,119.72 rg_BB4.16
  Inner1 w0.203: 33.78,54.62 v2(33.78,75.96) v2(33.78,86.12) v2(33.78,96.28) v2(33.78,106.44) v2(33.78,116.6) v2(33.78,126.76) v2(33.78,136.92) v2(33.78,147.08)
B3: length 142.7
  Top Layer w0.203: 31.24,98.75 33.09,98.75 33.27,98.56 v2(33.27,95.77) ; 31.24,119.07 33.09,119.07 33.27,118.88 v2(33.27,116.09) ; v2(33.27,105.93) 33.27,108.72 33.09,108.91 31.24,108.91 ; 31.24,88.59 33.09,88.59 33.27,88.4 v2(33.27,85.61) ; 31.24,129.23 33.09,129.23 33.27,129.04 v2(33.27,126.25) ; v2(33.27,146.57) 33.27,149.36 33.09,149.55 31.24,149.55 ; 31.24,139.39 33.09,139.39 33.27,139.2 v2(33.27,136.41) ; v2(33.27,75.45) 33.27,78.24 33.09,78.43 31.24,78.43
  Top Layer w0.254: 29.79,139.39 31.24,139.39 ; rg_BB4.15 31.24,119.07 ; rg_BB7.15 31.24,149.55 ; rg_BB5.15 31.24,129.23 ; rg_BB3.15 31.24,108.91 ; rg_BB1.15 31.24,88.59 ; rg_BB0.15 31.24,78.43 ; rg_BB2.15 31.24,98.75
  Inner1 w0.203: 33.27,54.62 v2(33.27,75.45) v2(33.27,85.61) v2(33.27,95.77) v2(33.27,105.93) v2(33.27,116.09) v2(33.27,126.25) v2(33.27,136.41) v2(33.27,146.57)
B4: length 129.4
  Top Layer w0.203: 31.24,108.26 32.47,108.26 32.77,107.96 v2(32.77,106.44) ; v2(32.77,86.12) 32.77,87.64 32.47,87.94 31.24,87.94 ; 31.24,138.74 32.47,138.74 32.77,138.44 v2(32.77,136.92) ; 31.24,77.78 32.47,77.78 32.77,77.48 v2(32.77,75.96) ; 31.24,98.1 32.47,98.1 32.77,97.8 v2(32.77,96.28) ; 31.24,118.42 32.47,118.42 32.77,118.12 v2(32.77,116.6) ; 31.24,148.9 32.47,148.9 32.77,148.6 v2(32.77,147.08) ; 31.24,128.58 32.47,128.58 32.77,128.28 v2(32.77,126.76)
  Top Layer w0.254: 29.79,128.58 31.24,128.58 ; 29.79,118.42 31.24,118.42 ; rg_BB3.14 31.24,108.26 ; rg_BB1.14 31.24,87.94 ; 29.79,148.9 31.24,148.9 ; rg_BB6.14 31.24,138.74 ; rg_BB0.14 31.24,77.78 ; rg_BB2.14 31.24,98.1
  Inner1 w0.203: v2(32.77,147.08) v2(32.77,136.92) v2(32.77,126.76) v2(32.77,116.6) v2(32.77,106.44) v2(32.77,96.28) v2(32.77,86.12) v2(32.77,75.96) 32.77,54.62
B5: length 123.9
  Top Layer w0.203: 31.24,138.09 32,138.09 32.26,137.83 v2(32.26,136.41) ; 31.24,87.29 32,87.29 32.26,87.03 v2(32.26,85.61) ; 31.24,77.13 32,77.13 32.26,76.87 v2(32.26,75.45) ; 31.24,107.61 32,107.61 32.26,107.35 v2(32.26,105.93) ; 31.24,117.77 32,117.77 32.26,117.51 v2(32.26,116.09) ; 31.24,148.25 32,148.25 32.26,147.99 v2(32.26,146.57) ; 31.24,127.93 32,127.93 32.26,127.67 v2(32.26,126.25) ; 31.24,97.45 32,97.45 32.26,97.19 v2(32.26,95.77)
  Top Layer w0.254: rg_BB0.13 31.24,77.13 ; rg_BB5.13 31.24,127.93 ; rg_BB1.13 31.24,87.29 ; rg_BB7.13 31.24,148.25 ; rg_BB3.13 31.24,107.61 ; rg_BB2.13 31.24,97.45 ; rg_BB6.13 31.24,138.09 ; rg_BB4.13 31.24,117.77
  Inner1 w0.203: 32.26,54.62 v2(32.26,75.45) v2(32.26,85.61) v2(32.26,95.77) v2(32.26,105.93) v2(32.26,116.09) v2(32.26,126.25) v2(32.26,136.41) v2(32.26,146.57)
B6: length 111
  Top Layer w0.203: v2(31.75,106.44) 31.75,106.69 31.48,106.96 31.24,106.96 ; 31.24,86.64 31.48,86.64 31.75,86.37 v2(31.75,86.12) ; v2(31.75,75.96) 31.75,76.21 31.48,76.48 31.24,76.48 ; v2(31.75,126.76) 31.75,127.01 31.48,127.28 31.24,127.28 ; v2(31.75,116.6) 31.75,116.85 31.48,117.12 31.24,117.12 ; 31.24,147.6 31.48,147.6 31.75,147.33 v2(31.75,147.08) ; 31.24,96.8 31.48,96.8 31.75,96.53 v2(31.75,96.28) ; 31.24,137.44 31.48,137.44 31.75,137.17 v2(31.75,136.92)
  Top Layer w0.254: rg_BB6.12 31.24,137.44 ; rg_BB5.12 31.24,127.28 ; rg_BB1.12 31.24,86.64 ; rg_BB0.12 31.24,76.48 ; rg_BB7.12 31.24,147.6 ; rg_BB3.12 31.24,106.96 ; rg_BB4.12 31.24,117.12 ; rg_BB2.12 31.24,96.8
  Inner1 w0.203: 31.75,54.62 v2(31.75,75.96) v2(31.75,86.12) v2(31.75,96.28) v2(31.75,106.44) v2(31.75,116.6) v2(31.75,126.76) v2(31.75,136.92) v2(31.75,147.08)
B7: length 106
  Top Layer w0.254: rg_BB5.11 31.12,126.63 31.24,126.5 v2(31.24,126.25) ; v2(31.24,105.93) 31.24,106.18 31.12,106.31 29.79,106.31 ; v2(31.24,75.45) 31.24,75.7 31.12,75.83 rg_BB0.11 ; rg_BB4.11 31.12,116.47 31.24,116.34 v2(31.24,116.09) ; 29.79,96.15 31.12,96.15 31.24,96.02 v2(31.24,95.77) ; v2(31.24,136.41) 31.24,136.66 31.12,136.79 rg_BB6.11 ; rg_BB7.11 31.12,146.95 31.24,146.82 v2(31.24,146.57) ; v2(31.24,85.61) 31.24,85.86 31.12,85.99 29.79,85.99
  Inner1 w0.203: 31.24,54.62 v2(31.24,75.45) v2(31.24,85.61) v2(31.24,95.77) v2(31.24,105.93) v2(31.24,116.09) v2(31.24,126.25) v2(31.24,136.41) v2(31.24,146.57)
C0: length 166.2
  Top Layer w0.203: v2(47.5,136.92) 47.5,140.98 47.14,141.34 43.94,141.34 ; 43.94,110.86 47.14,110.86 47.5,110.5 v2(47.5,106.44) ; v2(47.5,126.76) 47.5,130.82 47.14,131.18 43.94,131.18 ; 43.94,100.7 47.14,100.7 47.5,100.34 v2(47.5,96.28) ; v2(47.5,116.6) 47.5,120.66 47.14,121.02 43.94,121.02 ; v2(47.5,75.96) 47.5,80.02 47.14,80.38 43.94,80.38 ; v2(47.5,86.12) 47.5,90.18 47.14,90.54 43.94,90.54 ; v2(47.5,147.08) 47.5,151.14 47.14,151.5 43.94,151.5
  Top Layer w0.254: rg_BC7.18 43.94,151.5 ; rg_BC2.18 43.94,100.7 ; rg_BC6.18 43.94,141.34 ; rg_BC1.18 43.94,90.54 ; rg_BC0.18 43.94,80.38 ; rg_BC3.18 43.94,110.86 ; rg_BC4.18 43.94,121.02 ; rg_BC5.18 43.94,131.18
  Inner1 w0.203: v2(47.5,147.08) v2(47.5,136.92) v2(47.5,126.76) v2(47.5,116.6) v2(47.5,106.44) v2(47.5,96.28) v2(47.5,86.12) v2(47.5,75.96) 47.5,54.62
C1: length 161.1
  Top Layer w0.203: 43.94,150.85 46.78,150.85 46.99,150.63 v2(46.99,146.57) ; v2(46.99,95.77) 46.99,99.83 46.78,100.05 43.94,100.05 ; 43.94,120.37 46.78,120.37 46.99,120.15 v2(46.99,116.09) ; 43.94,130.53 46.78,130.53 46.99,130.31 v2(46.99,126.25) ; 43.94,110.21 46.78,110.21 46.99,109.99 v2(46.99,105.93) ; 43.94,79.73 46.78,79.73 46.99,79.51 v2(46.99,75.45) ; 43.94,140.69 46.78,140.69 46.99,140.47 v2(46.99,136.41) ; v2(46.99,85.61) 46.99,89.67 46.78,89.89 43.94,89.89
  Top Layer w0.254: rg_BC7.17 43.94,150.85 ; 42.5,110.21 43.94,110.21 ; rg_BC0.17 43.94,79.73 ; rg_BC1.17 43.94,89.89 ; rg_BC6.17 43.94,140.69 ; rg_BC5.17 43.94,130.53 ; rg_BC2.17 43.94,100.05 ; rg_BC4.17 43.94,120.37
  Inner1 w0.203: v2(46.99,146.57) v2(46.99,136.41) v2(46.99,126.25) v2(46.99,116.09) v2(46.99,105.93) v2(46.99,95.77) v2(46.99,85.61) v2(46.99,75.45) 46.99,54.62
C2: length 147.8
  Top Layer w0.203: v2(46.48,75.96) 46.48,78.75 46.16,79.08 43.94,79.08 ; v2(46.48,136.92) 46.48,139.71 46.16,140.04 43.94,140.04 ; 43.94,99.4 46.16,99.4 46.48,99.07 v2(46.48,96.28) ; v2(46.48,126.76) 46.48,129.55 46.16,129.88 43.94,129.88 ; v2(46.48,86.12) 46.48,88.91 46.16,89.24 43.94,89.24 ; 43.94,109.56 46.16,109.56 46.48,109.23 v2(46.48,106.44) ; 43.94,150.2 46.16,150.2 46.48,149.87 v2(46.48,147.08) ; v2(46.48,116.6) 46.48,119.39 46.16,119.72 43.94,119.72
  Top Layer w0.254: 43.94,150.2 rg_BC7.16 ; 43.94,99.4 rg_BC2.16 ; 43.94,140.04 rg_BC6.16 ; 43.94,89.24 rg_BC1.16 ; 43.94,119.72 rg_BC4.16 ; 43.94,79.08 rg_BC0.16 ; 43.94,129.88 rg_BC5.16 ; 43.94,109.56 rg_BC3.16
  Inner1 w0.203: 46.48,54.62 v2(46.48,75.96) v2(46.48,86.12) v2(46.48,96.28) v2(46.48,106.44) v2(46.48,116.6) v2(46.48,126.76) v2(46.48,136.92) v2(46.48,147.08)
C3: length 142.7
  Top Layer w0.203: 43.94,139.39 45.79,139.39 45.97,139.2 v2(45.97,136.41) ; v2(45.97,95.77) 45.97,98.56 45.79,98.75 43.94,98.75 ; v2(45.97,105.93) 45.97,108.72 45.79,108.91 43.94,108.91 ; v2(45.97,75.45) 45.97,78.24 45.79,78.43 43.94,78.43 ; v2(45.97,146.57) 45.97,149.36 45.79,149.55 43.94,149.55 ; 43.94,88.59 45.79,88.59 45.97,88.4 v2(45.97,85.61) ; 43.94,119.07 45.79,119.07 45.97,118.88 v2(45.97,116.09) ; v2(45.97,126.25) 45.97,129.04 45.79,129.23 43.94,129.23
  Top Layer w0.254: rg_BC7.15 43.94,149.55 ; rg_BC3.15 43.94,108.91 ; 42.5,139.39 43.94,139.39 ; rg_BC4.15 43.94,119.07 ; rg_BC0.15 43.94,78.43 ; rg_BC5.15 43.94,129.23 ; rg_BC2.15 43.94,98.75 ; rg_BC1.15 43.94,88.59
  Inner1 w0.203: 45.97,54.62 v2(45.97,75.45) v2(45.97,85.61) v2(45.97,95.77) v2(45.97,105.93) v2(45.97,116.09) v2(45.97,126.25) v2(45.97,136.41) v2(45.97,146.57)
C4: length 129.4
  Top Layer w0.203: 43.94,138.74 45.17,138.74 45.47,138.44 v2(45.47,136.92) ; 43.94,118.42 45.17,118.42 45.47,118.12 v2(45.47,116.6) ; 43.94,128.58 45.17,128.58 45.47,128.28 v2(45.47,126.76) ; v2(45.47,147.08) 45.47,148.6 45.17,148.9 43.94,148.9 ; v2(45.47,106.44) 45.47,107.96 45.17,108.26 43.94,108.26 ; v2(45.47,75.96) 45.47,77.48 45.17,77.78 43.94,77.78 ; v2(45.47,96.28) 45.47,97.8 45.17,98.1 43.94,98.1 ; 43.94,87.94 45.17,87.94 45.47,87.64 v2(45.47,86.12)
  Top Layer w0.254: rg_BC2.14 43.94,98.1 ; 42.5,128.58 43.94,128.58 ; rg_BC6.14 43.94,138.74 ; rg_BC0.14 43.94,77.78 ; 42.5,118.42 43.94,118.42 ; rg_BC3.14 43.94,108.26 ; 42.5,148.9 43.94,148.9 ; rg_BC1.14 43.94,87.94
  Inner1 w0.203: 45.47,54.62 v2(45.47,75.96) v2(45.47,86.12) v2(45.47,96.28) v2(45.47,106.44) v2(45.47,116.6) v2(45.47,126.76) v2(45.47,136.92) v2(45.47,147.08)
C5: length 123.9
  Top Layer w0.203: 43.94,107.61 44.7,107.61 44.96,107.35 v2(44.96,105.93) ; v2(44.96,116.09) 44.96,117.51 44.7,117.77 43.94,117.77 ; 43.94,127.93 44.7,127.93 44.96,127.67 v2(44.96,126.25) ; 43.94,97.45 44.7,97.45 44.96,97.19 v2(44.96,95.77) ; 43.94,87.29 44.7,87.29 44.96,87.03 v2(44.96,85.61) ; v2(44.96,75.45) 44.96,76.87 44.7,77.13 43.94,77.13 ; v2(44.96,136.41) 44.96,137.83 44.7,138.09 43.94,138.09 ; 43.94,148.25 44.7,148.25 44.96,147.99 v2(44.96,146.57)
  Top Layer w0.254: rg_BC2.13 43.94,97.45 ; rg_BC6.13 43.94,138.09 ; rg_BC4.13 43.94,117.77 ; rg_BC1.13 43.94,87.29 ; rg_BC5.13 43.94,127.93 ; rg_BC7.13 43.94,148.25 ; rg_BC3.13 43.94,107.61 ; rg_BC0.13 43.94,77.13
  Inner1 w0.203: 44.96,54.62 v2(44.96,75.45) v2(44.96,85.61) v2(44.96,95.77) v2(44.96,105.93) v2(44.96,116.09) v2(44.96,126.25) v2(44.96,136.41) v2(44.96,146.57)
C6: length 111
  Top Layer w0.203: 43.94,127.28 44.19,127.28 44.45,127.01 v2(44.45,126.76) ; v2(44.45,147.08) 44.45,147.33 44.19,147.6 43.94,147.6 ; v2(44.45,116.6) 44.45,116.85 44.19,117.12 43.94,117.12 ; v2(44.45,86.12) 44.45,86.37 44.19,86.64 43.94,86.64 ; v2(44.45,106.44) 44.45,106.69 44.19,106.96 43.94,106.96 ; v2(44.45,75.96) 44.45,76.21 44.19,76.48 43.94,76.48 ; 43.94,137.44 44.19,137.44 44.45,137.17 v2(44.45,136.92) ; v2(44.45,96.28) 44.45,96.53 44.19,96.8 43.94,96.8
  Top Layer w0.254: rg_BC0.12 43.94,76.48 ; rg_BC4.12 43.94,117.12 ; rg_BC2.12 43.94,96.8 ; rg_BC7.12 43.94,147.6 ; rg_BC6.12 43.94,137.44 ; rg_BC3.12 43.94,106.96 ; rg_BC5.12 43.94,127.28 ; rg_BC1.12 43.94,86.64
  Inner1 w0.203: v2(44.45,147.08) v2(44.45,136.92) v2(44.45,126.76) v2(44.45,116.6) v2(44.45,106.44) v2(44.45,96.28) v2(44.45,86.12) v2(44.45,75.96) 44.45,54.62
C7: length 106
  Top Layer w0.254: v2(43.94,95.77) 43.94,96.02 43.82,96.15 42.5,96.15 ; v2(43.94,146.57) 43.94,146.82 43.82,146.95 rg_BC7.11 ; v2(43.94,75.45) 43.94,75.7 43.82,75.83 rg_BC0.11 ; 42.5,106.31 43.82,106.31 43.94,106.18 v2(43.94,105.93) ; v2(43.94,85.61) 43.94,85.86 43.82,85.99 42.5,85.99 ; rg_BC6.11 43.82,136.79 43.94,136.66 v2(43.94,136.41) ; v2(43.94,116.09) 43.94,116.34 43.82,116.47 rg_BC4.11 ; rg_BC5.11 43.82,126.63 43.94,126.5 v2(43.94,126.25)
  Inner1 w0.203: 43.94,54.62 v2(43.94,75.45) v2(43.94,85.61) v2(43.94,95.77) v2(43.94,105.93) v2(43.94,116.09) v2(43.94,126.25) v2(43.94,136.41) v2(43.94,146.57)
OUT0: length 109.1
  Top Layer w0.254: rg_D4.2 v2(1.02,121.67) ; rg_D7.2 v2(1.02,152.15) ; rg_D2.2 v2(1.02,101.35) ; rg_D5.2 v2(1.02,131.83) ; rg_D3.2 v2(1.02,111.51) ; rg_D1.2 v2(1.02,91.19) ; rg_D6.2 v2(1.02,141.99) ; rg_D0.2 v2(1.02,81.03)
  Inner1 w0.203: v2(1.02,152.15) v2(1.02,141.99) v2(1.02,131.83) v2(1.02,121.67) v2(1.02,111.51) v2(1.02,101.35) v2(1.02,91.19) v2(1.02,81.03) 1.02,54.62
OUT1: length 112.5
  Top Layer w0.254: rg_D2.3 v2(0.51,100.7) ; rg_D0.3 v2(0.51,80.38) ; rg_D4.3 v2(0.51,121.02) ; rg_D6.3 v2(0.51,141.34) ; rg_D5.3 v2(0.51,131.18) ; rg_D7.3 v2(0.51,151.5) ; rg_D1.3 v2(0.51,90.54) ; rg_D3.3 v2(0.51,110.86)
  Inner1 w0.203: 0.51,54.62 v2(0.51,80.38) v2(0.51,90.54) v2(0.51,100.7) v2(0.51,110.86) v2(0.51,121.02) v2(0.51,131.18) v2(0.51,141.34) v2(0.51,151.5)
OUT2: length 115.9
  Top Layer w0.254: rg_D6.4 v2(0,140.69) ; 2.46,110.21 v2(0,110.21) ; rg_D1.4 v2(0,89.89) ; rg_D4.4 v2(0,120.37) ; rg_D5.4 v2(0,130.53) ; rg_D7.4 v2(0,150.85) ; rg_D0.4 v2(0,79.73) ; rg_D2.4 v2(0,100.05)
  Inner1 w0.203: 0,54.62 v2(0,79.73) v2(0,89.89) v2(0,100.05) v2(0,110.21) v2(0,120.37) v2(0,130.53) v2(0,140.69) v2(0,150.85)
OUT3: length 119.3
  Top Layer w0.254: rg_D2.5 v2(-0.51,99.4) ; rg_D6.5 v2(-0.51,140.04) ; rg_D1.5 v2(-0.51,89.24) ; rg_D4.5 v2(-0.51,119.72) ; rg_D5.5 v2(-0.51,129.88) ; rg_D7.5 v2(-0.51,150.2) ; rg_D0.5 v2(-0.51,79.08) ; rg_D3.5 v2(-0.51,109.56)
  Inner1 w0.203: v2(-0.51,150.2) v2(-0.51,140.04) v2(-0.51,129.88) v2(-0.51,119.72) v2(-0.51,109.56) v2(-0.51,99.4) v2(-0.51,89.24) v2(-0.51,79.08) -0.51,54.62
OUT4: length 122.8
  Top Layer w0.254: rg_D0.6 v2(-1.02,78.43) ; rg_D3.6 v2(-1.02,108.91) ; rg_D1.6 v2(-1.02,88.59) ; 2.46,139.39 v2(-1.02,139.39) ; rg_D5.6 v2(-1.02,129.23) ; rg_D2.6 v2(-1.02,98.75) ; rg_D7.6 v2(-1.02,149.55) ; rg_D4.6 v2(-1.02,119.07)
  Inner1 w0.203: -1.02,54.62 v2(-1.02,78.43) v2(-1.02,88.59) v2(-1.02,98.75) v2(-1.02,108.91) v2(-1.02,119.07) v2(-1.02,129.23) v2(-1.02,139.39) v2(-1.02,149.55)
OUT5: length 126.2
  Top Layer w0.254: rg_D6.7 v2(-1.52,138.74) ; rg_D3.7 v2(-1.52,108.26) ; 2.46,118.42 v2(-1.52,118.42) ; rg_D0.7 v2(-1.52,77.78) ; 2.46,148.9 v2(-1.52,148.9) ; rg_D2.7 v2(-1.52,98.1) ; 2.46,128.58 v2(-1.52,128.58) ; rg_D1.7 v2(-1.52,87.94)
  Inner1 w0.203: -1.52,54.62 v2(-1.52,77.78) v2(-1.52,87.94) v2(-1.52,98.1) v2(-1.52,108.26) v2(-1.52,118.42) v2(-1.52,128.58) v2(-1.52,138.74) v2(-1.52,148.9)
OUT6: length 129.6
  Top Layer w0.254: rg_D5.8 v2(-2.03,127.93) ; rg_D7.8 v2(-2.03,148.25) ; rg_D2.8 v2(-2.03,97.45) ; rg_D6.8 v2(-2.03,138.09) ; rg_D0.8 v2(-2.03,77.13) ; rg_D4.8 v2(-2.03,117.77) ; rg_D1.8 v2(-2.03,87.29) ; rg_D3.8 v2(-2.03,107.61)
  Inner1 w0.203: -2.03,54.62 v2(-2.03,77.13) v2(-2.03,87.29) v2(-2.03,97.45) v2(-2.03,107.61) v2(-2.03,117.77) v2(-2.03,127.93) v2(-2.03,138.09) v2(-2.03,148.25)
OUT7: length 133
  Top Layer w0.254: rg_D0.9 v2(-2.54,76.48) ; rg_D5.9 v2(-2.54,127.28) ; rg_D1.9 v2(-2.54,86.64) ; rg_D4.9 v2(-2.54,117.12) ; rg_D6.9 v2(-2.54,137.44) ; rg_D3.9 v2(-2.54,106.96) ; rg_D7.9 v2(-2.54,147.6) ; rg_D2.9 v2(-2.54,96.8)
  Inner1 w0.203: -2.54,54.62 v2(-2.54,76.48) v2(-2.54,86.64) v2(-2.54,96.8) v2(-2.54,106.96) v2(-2.54,117.12) v2(-2.54,127.28) v2(-2.54,137.44) v2(-2.54,147.6)
$3N32152: length 34.2
  Top Layer w0.254: rg_BB0.2 v2(25.65,81.03) ; rg_BC0.2 v2(38.35,81.03) ; v2(12.95,81.03) rg_BA0.2 8.2,81.03
  Inner2 w0.254: v2(12.95,81.03) 15.25,81.03 15.75,80.53 23.62,80.53 24.12,81.03 v2(25.65,81.03) 27.95,81.03 28.45,80.53 36.32,80.53 36.82,81.03 v2(38.35,81.03)
$3N32156: length 35.5
  Top Layer w0.254: 8.2,80.38 rg_BA0.3 v2(13.46,80.38) ; rg_BB0.3 v2(26.16,80.38) ; rg_BC0.3 v2(38.86,80.38)
  Inner2 w0.254: v2(38.86,80.38) 36.93,80.38 36.58,80.02 28.19,80.02 27.84,80.38 v2(26.16,80.38) 24.23,80.38 23.88,80.02 15.49,80.02 15.14,80.38 v2(13.46,80.38)
$3N32160: length 33.7
  Top Layer w0.254: 8.2,79.73 rg_BA0.4 v2(12.95,79.73) ; rg_BC0.4 v2(38.35,79.73) ; rg_BB0.4 v2(25.65,79.73)
  Inner2 w0.254: v2(12.95,79.73) 15.03,79.73 15.24,79.51 24.13,79.51 24.34,79.73 v2(25.65,79.73) 27.73,79.73 27.94,79.51 36.83,79.51 37.04,79.73 v2(38.35,79.73)
$3N32164: length 35
  Top Layer w0.254: rg_BB0.5 v2(26.16,79.08) ; 8.2,79.08 rg_BA0.5 v2(13.46,79.08) ; rg_BC0.5 v2(38.86,79.08)
  Inner2 w0.254: v2(38.86,79.08) 37.16,79.08 37.08,79.01 27.69,79.01 27.62,79.08 v2(26.16,79.08) 24.45,79.08 24.38,79.01 14.99,79.01 14.91,79.08 v2(13.46,79.08)
$3N32168: length 33.5
  Top Layer w0.254: rg_BB0.6 v2(25.65,78.43) ; v2(12.95,78.43) rg_BA0.6 8.2,78.43 ; rg_BC0.6 v2(38.35,78.43)
  Inner2 w0.254: v2(38.35,78.43) 37.16,78.43 37.08,78.5 27.69,78.5 27.62,78.43 v2(25.65,78.43) 24.45,78.43 24.38,78.5 14.99,78.5 14.91,78.43 v2(12.95,78.43)
$3N32172: length 35.2
  Top Layer w0.254: rg_BC0.7 v2(38.86,77.78) ; 8.2,77.78 rg_BA0.7 v2(13.46,77.78) ; rg_BB0.7 v2(26.16,77.78)
  Inner2 w0.254: v2(13.46,77.78) 14.77,77.78 14.99,77.99 24.38,77.99 24.6,77.78 v2(26.16,77.78) 27.47,77.78 27.69,77.99 37.08,77.99 37.3,77.78 v2(38.86,77.78)
$3N32176: length 33.9
  Top Layer w0.254: 8.2,77.13 rg_BA0.8 v2(12.95,77.13) ; rg_BB0.8 v2(25.65,77.13) ; rg_BC0.8 v2(38.35,77.13)
  Inner2 w0.254: v2(12.95,77.13) 14.88,77.13 15.24,77.48 24.13,77.48 24.48,77.13 v2(25.65,77.13) 27.59,77.13 27.94,77.48 36.83,77.48 37.19,77.13 v2(38.35,77.13)
$3N32180: length 35.7
  Top Layer w0.254: 8.2,76.48 rg_BA0.9 v2(13.46,76.48) ; rg_BB0.9 v2(26.16,76.48) ; rg_BC0.9 v2(38.86,76.48)
  Inner2 w0.254: v2(38.86,76.48) 37.07,76.48 36.58,76.97 28.19,76.97 27.7,76.48 v2(26.16,76.48) 24.37,76.48 23.88,76.97 15.49,76.97 15,76.48 v2(13.46,76.48)
$3N32219: length 6.6
  Top Layer w0.203: v2(6.62,73.91) 5.36,72.66 rg_U1.2
  Top Layer w0.254: 8.2,75.83 v2(6.6,75.83)
  Bottom Layer w0.203: v2(6.62,73.91) 6.62,75.81 v2(6.6,75.83)
$3N33083: length 16.6
  Top Layer w0.254: v2(43.43,82.56) 43.94,82.56 44.2,82.31 44.2,81.55 43.68,81.03 rg_BC0.19 ; rg_DCC.1 v2(43.2,71.13)
  Bottom Layer w0.203: v2(43.43,82.56) 43.43,71.89 43.2,71.66 v2(43.2,71.13)
